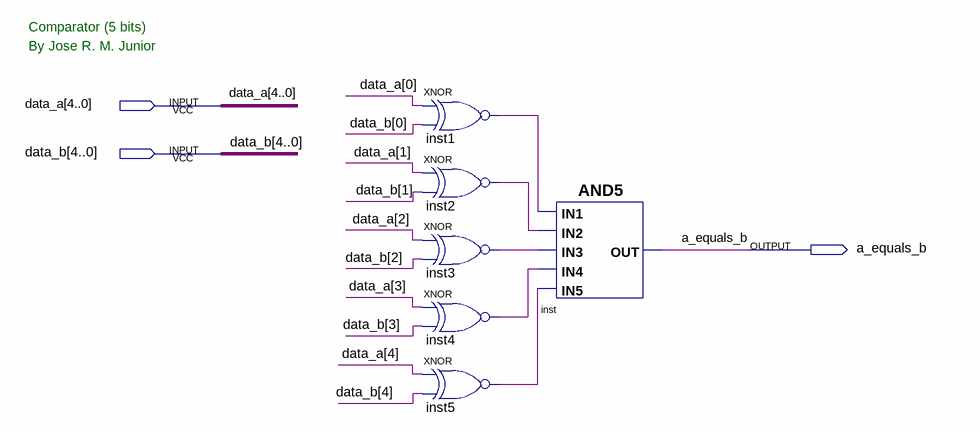
[diagram p0: schematic sheet]
// Quartus schematic comparator_5bits.bdf as structural Verilog: 6 symbols, 3 pins
module comparator_5bits (
  input  [4:0] data_a,
  input  [4:0] data_b,
  output a_equals_b
);

  wire inst1_out, inst2_out, inst3_out, inst4_out, inst5_out;

  xnor inst1 (inst1_out, data_a[0], data_b[0]);
  xnor inst2 (inst2_out, data_a[1], data_b[1]);
  xnor inst3 (inst3_out, data_a[2], data_b[2]);
  xnor inst4 (inst4_out, data_a[3], data_b[3]);
  xnor inst5 (inst5_out, data_a[4], data_b[4]);
  and inst (a_equals_b, inst1_out, inst2_out, inst3_out, inst4_out, inst5_out);

  // Notes on the sheet:
  //   Comparator (5 bits)
  //   By Jose R. M. Junior
endmodule
